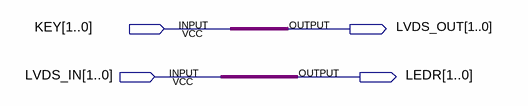
[diagram p0: schematic sheet]
// Quartus schematic test_lvds_de2.bdf as structural Verilog: 0 symbols, 4 pins
module test_lvds_de2 (
  input  [1:0] KEY,
  input  [1:0] LVDS_IN,
  output [1:0] LVDS_OUT,
  output [1:0] LEDR
);


  assign LEDR = LVDS_IN;
  assign LVDS_OUT = KEY;
endmodule
